# Altium project ingredionradar.PrjPcb
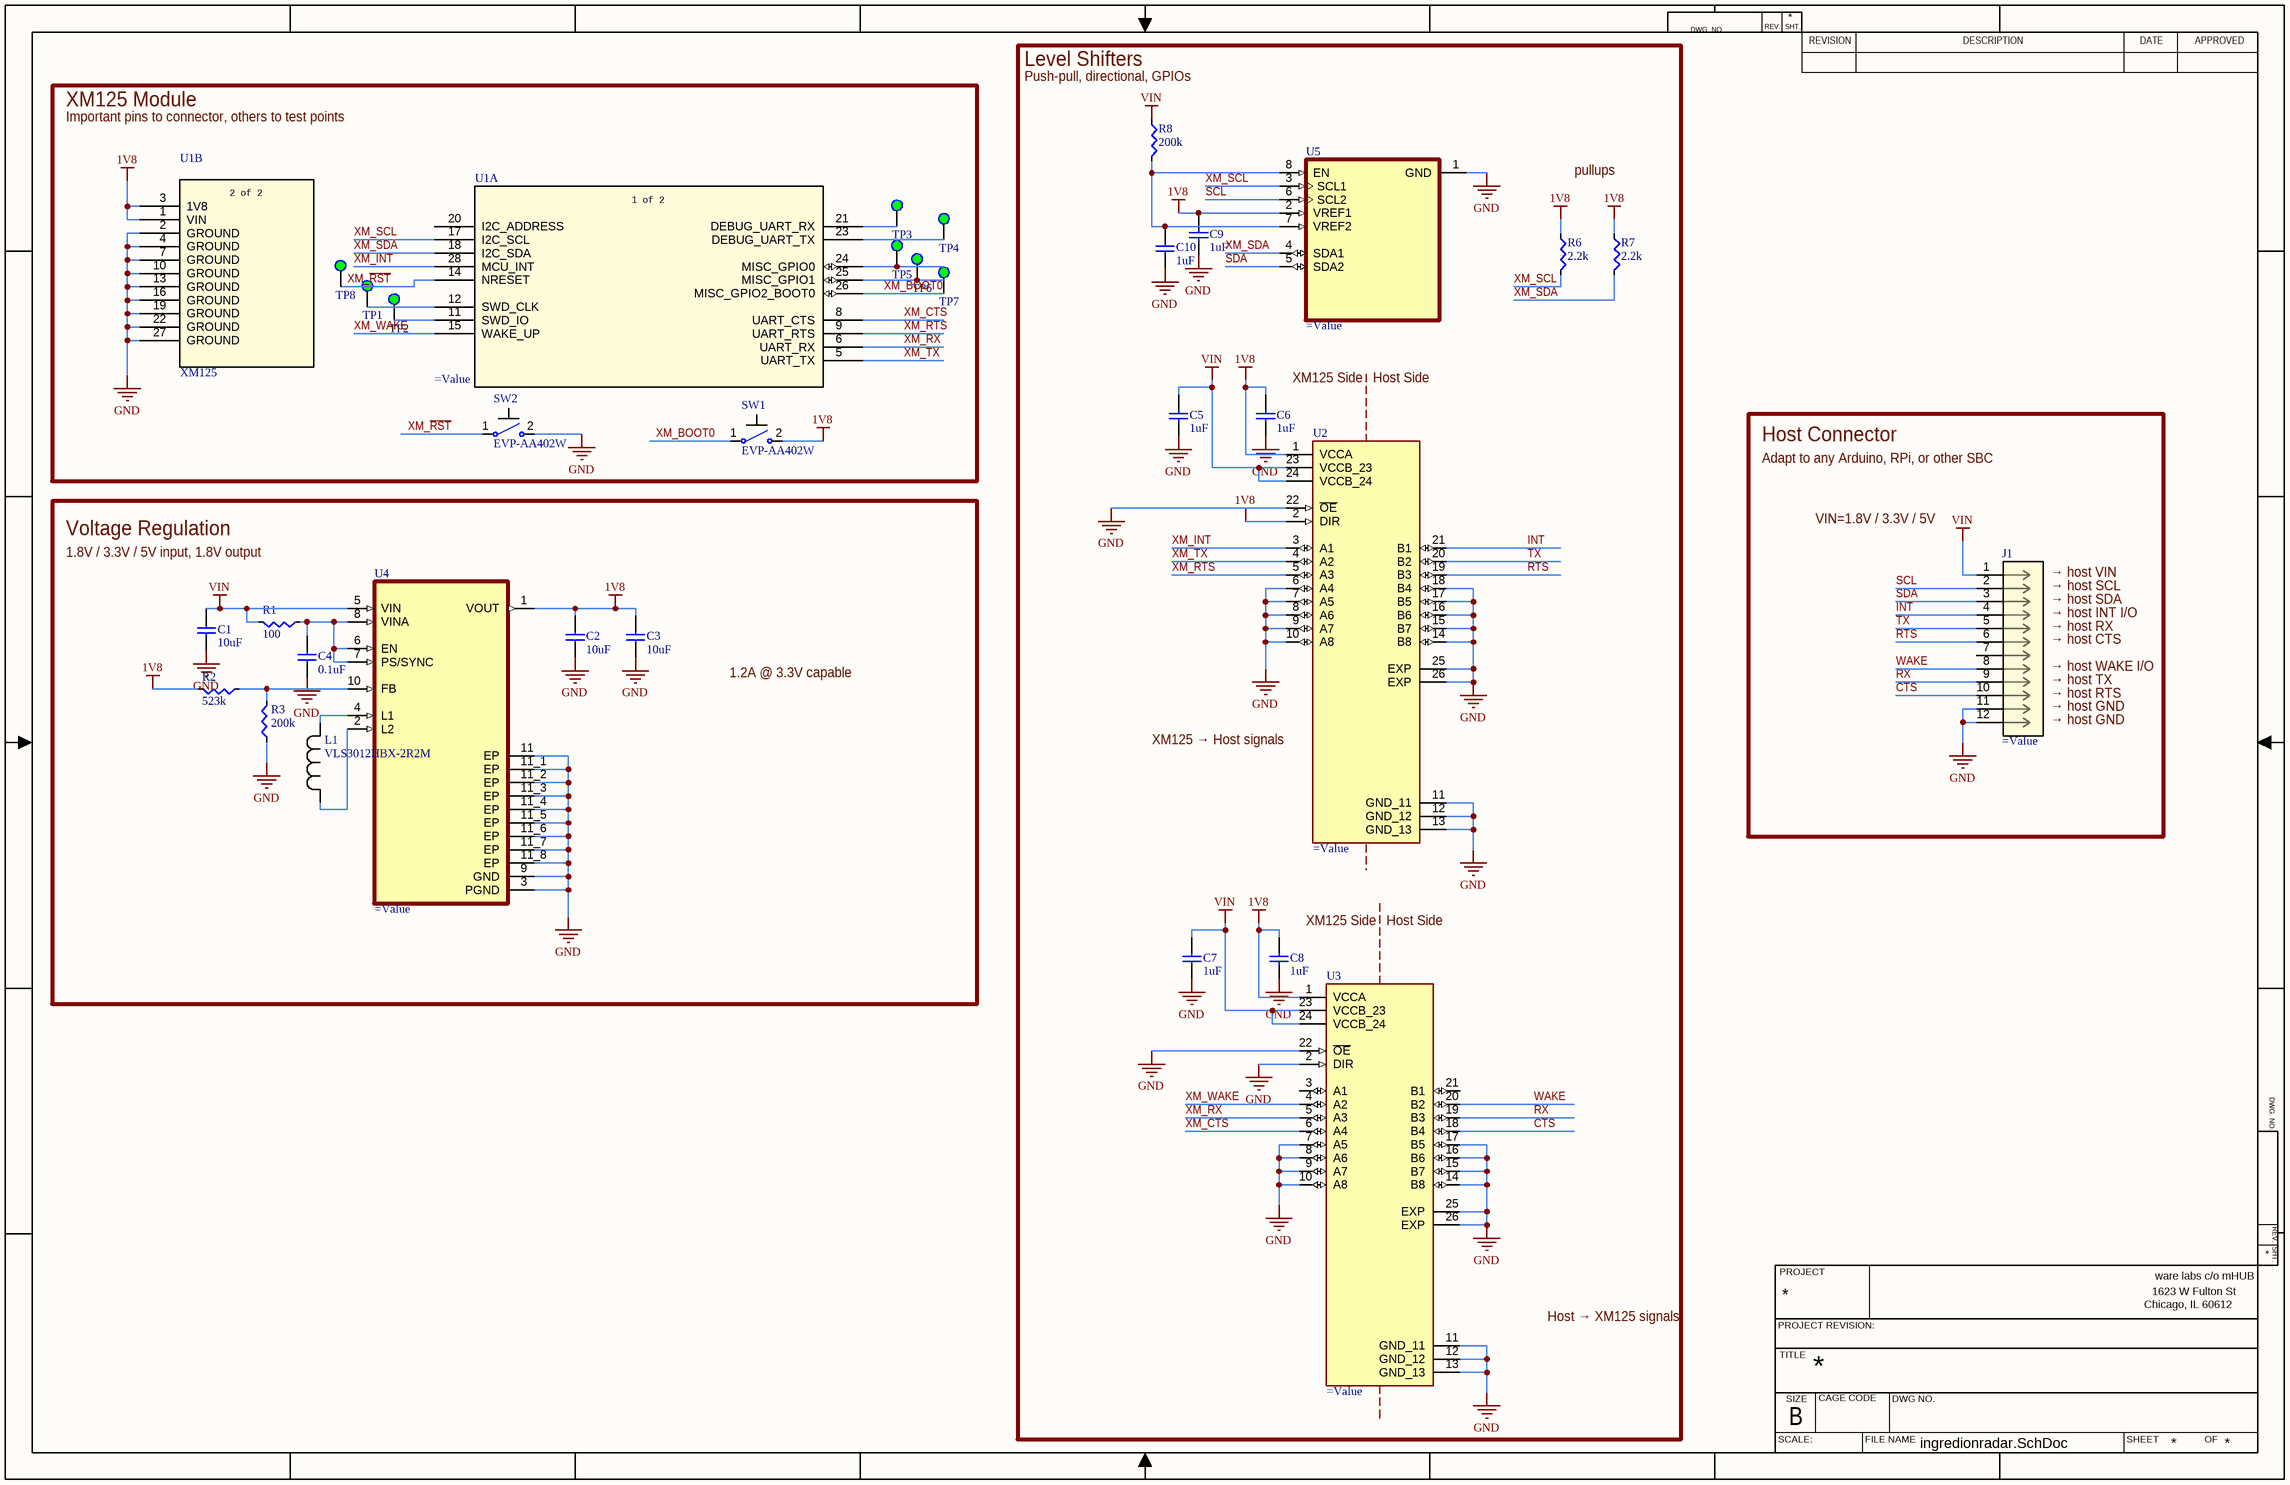
[diagram p0: ingredionradar.SchDoc]
author: John Pritchard
1 sheet, 33 parts. Net scope: global (net labels, ports and power ports of the same name join across sheets).
Board file: ingredionradar.PcbDoc

## Sheet ingredionradar.SchDoc
size 431 x 279 mm; Organization: ORGANIZATION; Address1: ware labs c/o mHUB; Address2: 1623 W Fulton St; Address3: Chicago, IL 60612; Address4: ADDRESS 4; Revision: -; ENG_APP_DATE: --/--/--; DSN_APP_DATE: --/--/--; CHK_APP_DATE: --/--/--

### Parts
C1  10uF  [CAP0603]
C2  10uF  [CAP0603]
C3  10uF  [CAP0603]
C4  0.1uF  [CAP0402]
C5  1uF  [CAP0402]
C6  1uF  [CAP0402]
C7  1uF  [CAP0402]
C8  1uF  [CAP0402]
C9  1uF  [CAP0402]
C10  1uF  [CAP0402]
J1  (no value)  [CONN_SM12B-SRSS-TBLFSN_JST]
L1  VLS3012HBX-2R2M  [IND_VLS3012HBX_TDK]
R1  100  [RES0402]
R2  523k  [RES0402]
R3  200k  [RES0402]
R6  2.2k  [RES0402]
R7  2.2k  [RES0402]
R8  200k  [RES0402]
SW1  EVP-AA402W  [EVPXA]
SW2  EVP-AA402W  [EVPXA]
TP1  TP_SMT  [TP_SMT_1.5MM]  (value not drawn)
TP2  TP_SMT  [TP_SMT_1.5MM]  (value not drawn)
TP3  TP_SMT  [TP_SMT_1.5MM]  (value not drawn)
TP4  TP_SMT  [TP_SMT_1.5MM]  (value not drawn)
TP5  TP_SMT  [TP_SMT_1.5MM]  (value not drawn)
TP6  TP_SMT  [TP_SMT_1.5MM]  (value not drawn)
TP7  TP_SMT  [TP_SMT_1.5MM]  (value not drawn)
TP8  TP_SMT  [TP_SMT_1.5MM]  (value not drawn)
U1  (no value)  [XM125_ACC]  (parts A,B of 2)
U2  (no value)  [IC_SN74LVC8T245RHLR]
U3  (no value)  [IC_SN74LVC8T245RHLR]
U4  (no value)  [CONV_TPS63000DRCR]
U5  (no value)  [SON35P140X100X40-8N]

### Blocks framed on the sheet
Level Shifters: C5-C10 R6-R8 U2 U3 U5
XM125 Module: SW1 SW2 TP1-TP8 U1
Host Connector: J1
Voltage Regulation: C1-C4 L1 R1-R3 U4

### Nets
1V8: C2.2 C3.2 C6.2 C8.2 C9.2 R2.2 R6.1 R7.1 SW1.2 U1.1(VIN) U1.3(1V8) U2.1(VCCA) U2.2(DIR) U3.1(VCCA) U4.1(VOUT) U5.2(VREF1)
GND: C1.1 C2.1 C3.1 C4.1 C5.1 C6.1 C7.1 C8.1 C9.1 C10.1 J1.11 J1.12 R3.1 SW2.2 U1.2(GROUND) U1.4(GROUND) U1.7(GROUND) U1.10(GROUND) U1.13(GROUND) U1.16(GROUND) U1.19(GROUND) U1.22(GROUND) U1.27(GROUND) U2.6(A4) U2.7(A5) U2.8(A6) U2.9(A7) U2.10(A8) U2.11(GND_11) U2.12(GND_12) U2.13(GND_13) U2.14(B8) U2.15(B7) U2.16(B6) U2.17(B5) U2.18(B4) U2.22(~{OE}) U2.25(EXP) U2.26(EXP) U3.2(DIR) U3.7(A5) U3.8(A6) U3.9(A7) U3.10(A8) U3.11(GND_11) U3.12(GND_12) U3.13(GND_13) U3.14(B8) U3.15(B7) U3.16(B6) U3.17(B5) U3.22(~{OE}) U3.25(EXP) U3.26(EXP) U4.3(PGND) U4.9(GND) U4.11(EP) U4.11_1(EP) U4.11_2(EP) U4.11_3(EP) U4.11_4(EP) U4.11_5(EP) U4.11_6(EP) U4.11_7(EP) U4.11_8(EP) U5.1(GND)
VIN: C1.2 C5.2 C7.2 J1.1 R1.2 R8.1 U2.23(VCCB_23) U2.24(VCCB_24) U3.23(VCCB_23) U3.24(VCCB_24) U4.5(VIN)
CTS: J1.10 U3.18(B4)
INT: J1.4 U2.21(B1)
RTS: J1.6 U2.19(B3)
RX: J1.9 U3.19(B3)
SCL: J1.2 U5.6(SCL2)
SDA: J1.3 U5.5(SDA2)
TX: J1.5 U2.20(B2)
WAKE: J1.8 U3.20(B2)
XM_BOOT0: SW1.1 TP7.1(TP) U1.26(MISC_GPIO2_BOOT0)
XM_CTS: U1.8(UART_CTS) U3.6(A4)
XM_INT: U1.28(MCU_INT) U2.3(A1)
XM_~{RST}: SW2.1 TP8.1(TP) U1.14(NRESET)
XM_RTS: U1.9(UART_RTS) U2.5(A3)
XM_RX: U1.6(UART_RX) U3.5(A3)
XM_SCL: R6.2 U1.17(I2C_SCL) U5.3(SCL1)
XM_SDA: R7.2 U1.18(I2C_SDA) U5.4(SDA1)
XM_TX: U1.5(UART_TX) U2.4(A2)
XM_WAKE: U1.15(WAKE_UP) U3.4(A2)
NetC4_2: C4.2 R1.1 U4.6(EN) U4.7(PS/SYNC) U4.8(VINA)
NetC10_2: C10.2 R8.2 U5.7(VREF2) U5.8(EN)
NetL1_1: L1.1 U4.4(L1)
NetL1_2: L1.2 U4.2(L2)
NetR2_1: R2.1 R3.2 U4.10(FB)
NetTP1_1: TP1.1(TP) U1.12(SWD_CLK)
NetTP2_1: TP2.1(TP) U1.11(SWD_IO)
NetTP3_1: TP3.1(TP) U1.21(DEBUG_UART_RX)
NetTP4_1: TP4.1(TP) U1.23(DEBUG_UART_TX)
NetTP5_1: TP5.1(TP) U1.24(MISC_GPIO0)
NetTP6_1: TP6.1(TP) U1.25(MISC_GPIO1)

Not connected (* = marked no-connect by the designer): J1 7; U1 20(I2C_ADDRESS); U3 3(A1) 21(B1)

### Notes on the sheet
- (near R8) Push-pull, directional, GPIOs
- Important pins to connector, others to test points
- pullups
- (near C6) XM125 Side
- Host Side
- Adapt to any Arduino, RPi, or other SBC
- 1.8V / 3.3V / 5V input, 1.8V output
- VIN=1.8V / 3.3V / 5V
- (near J1) → host VIN
- (near J1) → host SCL
- (near J1) → host SDA
- (near J1) → host INT I/O
- (near J1) → host RX
- 1.2A @ 3.3V capable
- (near J1) → host CTS
- (near J1) → host WAKE I/O
- (near J1) → host TX
- (near J1) → host RTS
- (near U2) XM125 → Host signals
- (near J1) → host GND
- (near C8) XM125 Side
- Host → XM125 signals
- DWG. NO.
- REV.
- SHT.
- REVISION
- DESCRIPTION
- DATE
- APPROVED
- PROJECT
- PROJECT REVISION:
- TITLE
- SCALE:
- SIZE
- B
- CAGE CODE
- FILE NAME
- DWG NO.
- SHEET
- OF
- (in symbol XM125, part A) 1 of 2
- (in symbol XM125, part B) 2 of 2

### Library data of the parts
C1-C3 = CAP: Chip Capacitor; Manufacturer: Samsung Electro-Mechanics; Part Number: CL10X106MO8NRNC; Note: CAP CER 10UF 16V X6S 0603; Specification: 10 µF ±20% 16V Ceramic Capacitor X6S 0603 (1608 Metric); Value: 10uF
C4 = CAP: Chip Capacitor; Manufacturer: Samsung Electro-Mechanics; Part Number: CL05B104KP5NNNC; Note: CAP CER 0.1UF 10V X7R 0402; Specification: 0.1 µF ±10% 10V Ceramic Capacitor X7R 0402 (1005 Metric); Value: 0.1uF
C5-C10 = CAP: Chip Capacitor; Manufacturer: Samsung Electro-Mechanics; Part Number: CL05B105KQ5NQNC; Note: CAP CER 1UF 6.3V X7R 0402; Specification: 1 µF ±10% 6.3V Ceramic Capacitor X7R 0402 (1005 Metric); Value: 1uF
J1 = SM12B-SRSS-TBLFSN: Description; Manufacturer: JST Sales America Inc.; Note: CONN HEADER SMD R/A 12POS 1MM; Specification: Connector Header Surface Mount, Right Angle 12 position 0.039" (1.00mm); Part Number: SM12B-SRSS-TB; Value: SM12B-SRSS-TB
L1 = VLS3012HBX-2R2M: Description; Manufacturer: TDK Corporation; Note: FIXED IND 2.2UH 3.15A 106 MOHM; Specification: 2.2 µH Shielded Drum Core, Wirewound Inductor 3.15 A 106mOhm Max Nonstandard; Part Number: VLS3012HBX-2R2M; Value: VLS3012HBX-2R2M
R1 = RES: Chip Resistor; Manufacturer: Samsung Electro-Mechanics; Part Number: RCS1005F101CS; Note: RES 100 OHM 1% 1/16W 0402; Specification: 100 Ohms ±1% 0.063W, 1/16W Chip Resistor 0402 (1005 Metric) Anti-Sulfur, Moisture Resistant Thick Film; Value: 100
R2 = RES: Chip Resistor; Manufacturer: Samsung Electro-Mechanics; Part Number: RCS1005F5233CS; Note: RES 523K OHM 1% 1/16W 0402; Specification: 523 kOhms ±1% 0.063W, 1/16W Chip Resistor 0402 (1005 Metric) Anti-Sulfur, Moisture Resistant Thick Film; Value: 523k
R3 = RES: Chip Resistor; Manufacturer: Samsung Electro-Mechanics; Part Number: RCS1005F204CS; Note: RES 200K OHM 1% 1/16W 0402; Specification: 200 kOhms ±1% 0.063W, 1/16W Chip Resistor 0402 (1005 Metric) Anti-Sulfur, Moisture Resistant Thick Film; Value: 200k
R6 R7 = RES: Chip Resistor; Manufacturer: Samsung Electro-Mechanics; Part Number: RC1005F222CS; Note: RES SMD 2.2K OHM 1% 1/16W 0402; Specification: 2.2 kOhms ±1% 0.063W, 1/16W Chip Resistor 0402 (1005 Metric) Moisture Resistant Thick Film; Value: 2.2k
R8 = RES: Chip Resistor; Manufacturer: Samsung Electro-Mechanics; Part Number: RC1005J204CS; Note: RES SMD 200K OHM 5% 1/16W 0402; Specification: 200 kOhms ±5% 0.063W, 1/16W Chip Resistor 0402 (1005 Metric) Moisture Resistant Thick Film; Value: 200k
SW1 SW2 = SW_TACT: SPST, Off-Mom, no ground pin; Value: EVP-AA402W
TP1-TP8 = Test Point: Value: TP_SMT
U1 = XM125: Description; Manufacturer: Acconeer AB; Note: A121 ENTRY+ RADAR SENSOR MODULE; Specification: Radar Sensor Output; Value: XM125; Part Number: XM125
U2 U3 = SN74LVC8T245RHLR: 8-Bit Dual-Supply Bus Transceiver with Configurable Voltage-Level Shifting and Three-State Outputs 24-VQFN -40 to 85; Manufacturer: Texas Instruments; Note: IC TRANSLATION TXRX 5.5V 24-VQFN; Specification: Translation Transceiver 1 Element 8 Bit per Element 3-State Output 24-VQFN (5.5x3.5); Value: SN74LVC8T245RHLR; Part Number: SN74LVC8T245RHLR
U4 = TPS63000DRCR: 96% Buck-Boost Converter with 1.8A Current Switches in 3x3 QFN 10-VSON -40 to 85; Manufacturer: Texas Instruments; Note: IC REG BUCK BST ADJ 1.6A 10VSON; Specification: Buck-Boost Switching Regulator IC Positive Adjustable 1.2V 1 Output 1.6A (Switch) 10-VFDFN Exposed Pad; Value: TPS63000DRCR; Part Number: TPS63000DRCR
U5 = PCA9306DQER: 2-bit bidirectional 400-kHz I2C/SMBus voltage level translator; Manufacturer: Texas Instruments; Note: IC XLTR VL BIDIR 8-X2SON; Specification: Voltage Level Translator Bidirectional 1 Circuit 2 Channel 8-X2SON (1.4x1); Value: PCA9306DQER; Part Number: PCA9306DQER